# Altium project Probe.PrjPCB
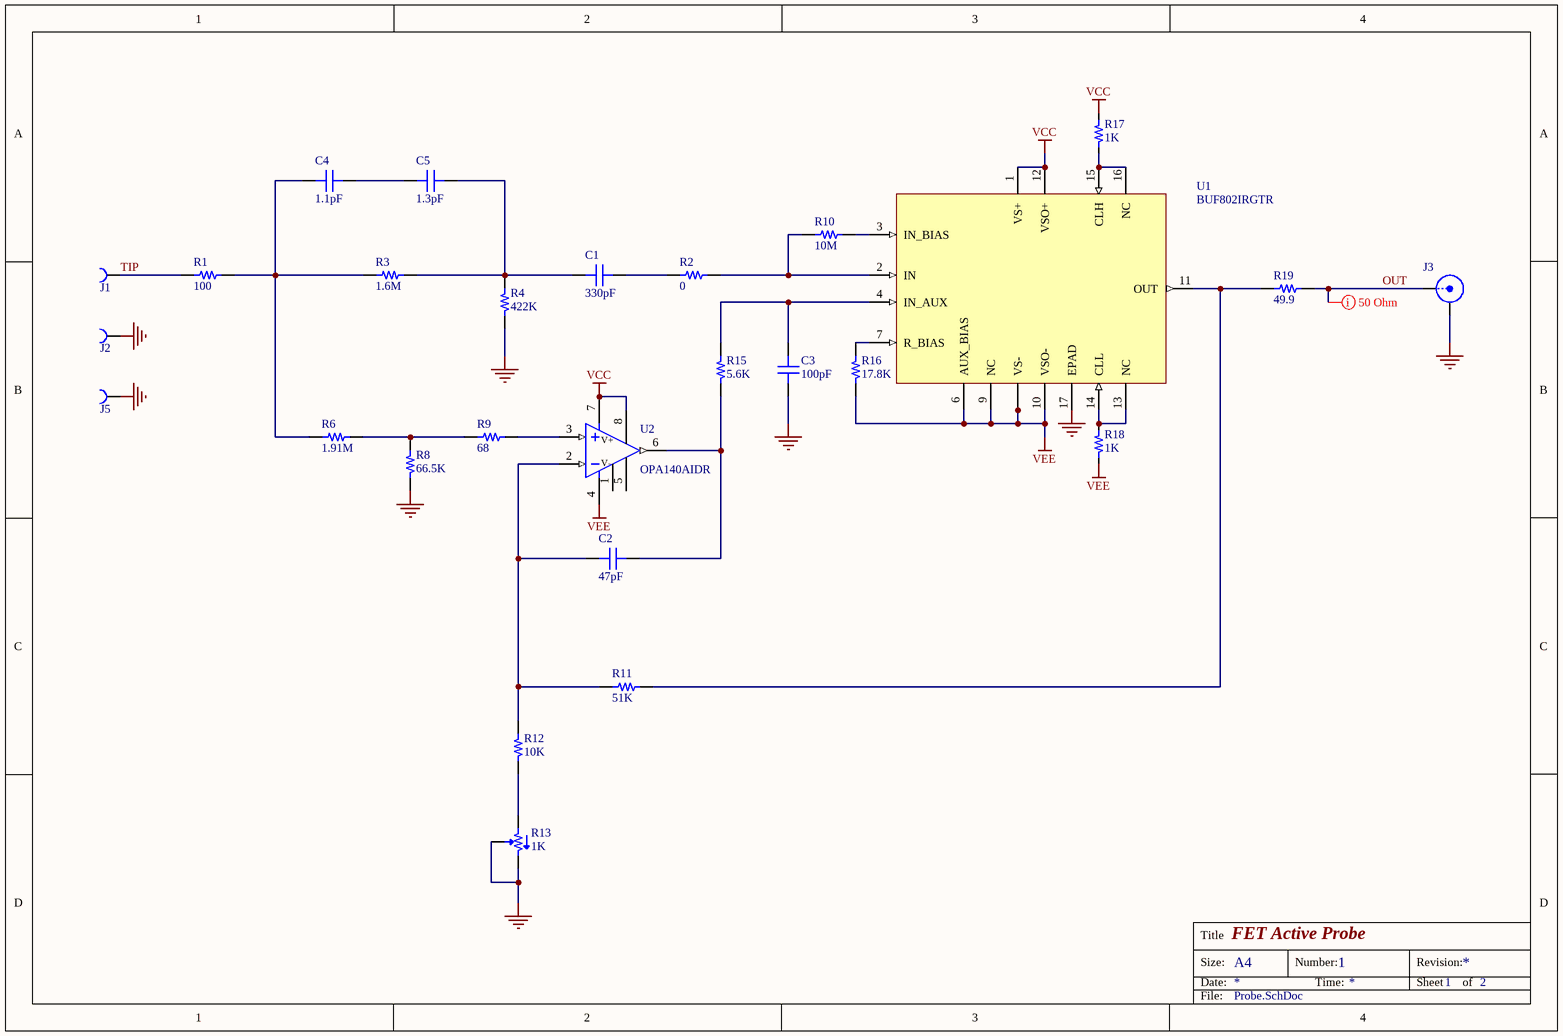
[diagram p0: Probe.SchDoc]
Draft: =#32
2 sheets, 69 parts. Net scope: global (net labels, ports and power ports of the same name join across sheets).
Board file: Probe.PcbDoc
Sheets:
  Probe.SchDoc
  Power.SchDoc

## Sheet Probe.SchDoc: FET Active Probe
size A4; DocumentNumber: 1; SheetNumber: 1; SheetTotal: 2

### Parts
C1  330pF  [CAP 0402/1005]
C2  47pF  [CAP 0402/1005]
C3  100pF  [CAP 0402/1005]
C4  1.1pF  [CAP 0402/1005 RF]
C5  1.3pF  [CAP 0402/1005 RF]
J1  0339-0-15-01-15-27-10-0  [MILL-MAX 0339]  (value not drawn)
J2  0339-0-15-01-15-27-10-0  [MILL-MAX 0339]  (value not drawn)
J3  CONN SMA JACK EDGE MNT  [60312202114513]  (value not drawn)
J5  0339-0-15-01-15-27-10-0  [MILL-MAX 0339]  (value not drawn)
R1  100  [RES 0402/1005]
R2  0  [RES 0402/1005]
R3  1.6M  [RES 0402/1005]
R4  422K  [RES 0402/1005]
R6  1.91M  [RES 0402/1005]
R8  66.5K  [RES 0402/1005]
R9  68  [RES 0402/1005]
R10  10M  [RES 0402/1005]
R11  51K  [RES 0402/1005]
R12  10K  [RES 0402/1005]
R13  1K  [BOURNS 3224W]
R15  5.6K  [RES 0402/1005]
R16  17.8K  [RES 0402/1005]
R17  1K  [RES 0402/1005]
R18  1K  [RES 0402/1005]
R19  49.9  [RES 0402/1005]
U1  BUF802IRGTR  [QFN50P305X305X100_HS-17N]
U2  OPA140AIDR  [TI SOIC-8 D]

### Nets
GND: C3.2 J2.1 J3.2(Y) J5.1 R4.2 R8.2 R13.2 R13.3 U1.17(EPAD)
VCC: R17.2 U1.1(VS+) U1.12(VSO+) U2.7(V+) U2.8
VEE: R16.2 R18.2 U1.5(VS-) U1.6(AUX_BIAS) U1.8(VS-) U1.9(NC) U1.10(VSO-) U2.4(V-)
OUT: J3.1(X) R19.2
TIP: J1.1 R1.1
NetC1_1: C1.1 C5.2 R3.2 R4.1
NetC1_2: C1.2 R2.1
NetC2_1: C2.1 R11.1 R12.1 U2.2(-IN)
NetC2_2: C2.2 R15.2 U2.6(OUT)
NetC3_1: C3.1 R15.1 U1.4(IN_AUX)
NetC4_1: C4.1 R1.2 R3.1 R6.1
NetC4_2: C4.2 C5.1
NetR2_2: R2.2 R10.1 U1.2(IN)
NetR6_2: R6.2 R8.1 R9.1
NetR9_2: R9.2 U2.3(+IN)
NetR10_2: R10.2 U1.3(IN_BIAS)
NetR11_2: R11.2 R19.1 U1.11(OUT)
NetR12_2: R12.2 R13.1
NetR16_1: R16.1 U1.7(R_BIAS)
NetR17_1: R17.1 U1.15(CLH) U1.16(NC)
NetR18_1: R18.1 U1.13(NC) U1.14(CLL)

Not connected (* = marked no-connect by the designer): U2 1 5(10)

### Layout directives
rule Width Constraint [Pref Impedance = 50.00ohms    Min Impedance = 50.00ohms    Max Impedance = 50.00ohms]: OUT

### Notes on the sheet
- Title
- Size:
- Date:
- A4
- Number:
- Time:
- Revision:
- Sheet
- of
- File:

### Library data of the parts
C1 = CM0293: CAP CER 330PF 50V NP0 0402; Manufacturer: Murata; Part Number: GRM1555C1H331JA01D; Tolerance: 5%; TemperatureRange: -55C ~ 125C; TemperatureCoefficient: C0G, NP0; Value: 330pF; PartId: CM0293; Supplier 1: Digi-Key; Supplier Part Number 1: 490-1295-2-ND; ComponentLink1Description: Datasheet; ComponentLink1URL: http://www.murata.com/~/media/webrenewal/support/library/catalog/products/capacitor/mlcc/c02e.ashx; ComponentLink2Description: Digi-Key listing; ComponentLink2URL: http://digikey.com/product-detail/en/GRM1555C1H331JA01D/490-1295-2-ND/587206; Voltage: 50V; Price: 0.009; Type: -; Device Package: 0402 (1005 Metric)
C2 = CM0224: CAP CER 47PF 50V NP0 0402; Manufacturer: Murata; Part Number: GRM1555C1H470FA01D; Tolerance: 1%; TemperatureRange: -55C ~ 125C; TemperatureCoefficient: C0G, NP0; Value: 47pF; PartId: CM0224; Supplier 1: Digi-Key; Supplier Part Number 1: 490-6241-2-ND; ComponentLink1Description: Datasheet; ComponentLink1URL: http://www.murata.com/~/media/webrenewal/support/library/catalog/products/capacitor/mlcc/c02e.ashx; ComponentLink2Description: Digi-Key listing; ComponentLink2URL: http://digikey.com/product-detail/en/GRM1555C1H470FA01D/490-6241-2-ND/3693991; Voltage: 50V; Price: 0.0133; Type: -; Device Package: 0402 (1005 Metric)
C3 = CM0248: CAP CER 100PF 50V NP0 0402; Manufacturer: Murata; Part Number: GRM1555C1H101FA01D; Tolerance: 1%; TemperatureRange: -55C ~ 125C; TemperatureCoefficient: C0G, NP0; Value: 100pF; PartId: CM0248; Supplier 1: Digi-Key; Supplier Part Number 1: 490-8180-2-ND; ComponentLink1Description: Datasheet; ComponentLink1URL: http://www.murata.com/~/media/webrenewal/support/library/catalog/products/capacitor/mlcc/c02e.pdf; ComponentLink2Description: Digi-Key Listing; ComponentLink2URL: https://www.digikey.com/product-detail/en/murata-electronics-north-america/GRM1555C1H101FA01D/490-8180-2-ND/3693919; Voltage: 50V; Price: 0.0092; Device Package: 0402 (1005 Metric)
C4 = CR1657: CAP CER 1.1PF +-0.05PF 50V NP0 0201; Part Number: GJM1555C1H1R1WB01D; Manufacturer: Murata; TemperatureRange: -55C ~ 125C; TemperatureCoefficient: C0G, NP0; Type: High Q, Low Loss; Tolerance: 0.05pF; Value: 1.1pF; PartId: CR1657; Supplier 1: Mouser; Supplier Part Number 1: 81-GJM1555C1H1R1WB01D; ComponentLink1Description: Datasheet; Voltage: 50V; Price: 0.02; Device Package: 0402 (1005 Metric); ComponentLink1URL: https://www.murata.com/en-eu/products/capacitor/ceramiccapacitor/overview/lineup/smd/gjm
C5 = CR1663: CAP CER 1.3PF +-0.05PF 50V NP0 0201; Part Number: GJM1555C1H1R3WB01D; Manufacturer: Murata; Tolerance: 0.05pF; TemperatureRange: -55C ~ 125C; TemperatureCoefficient: C0G, NP0; Type: High Q, Low Loss; Value: 1.3pF; PartId: CR1663; Supplier 1: Mouser; Supplier Part Number 1: 81-GJM1555C1H1R3WB01D; ComponentLink1Description: Datasheet; ComponentLink1URL: https://www.murata.com/en-eu/products/capacitor/ceramiccapacitor/overview/lineup/smd/gjm; Voltage: 50V; Price: 0.02; Device Package: 0402 (1005 Metric)
J1 J2 J5 = 0339-0-15-01-15-27-10-0: CONN PIN RCPT; Manufacturer: Mill-Max; Supplier 1: Digi-Key; Supplier Part Number 1: 0339-0-15-01-15-27-10-0-ND; Part Number: 0339-0-15-01-15-27-10-0; Stock 1: 989; Pricing 1: 1=1.42, 10=1.234, 25=1.1812, 50=1.155, 100=1.1025, 250=0.99748, 500=0.91874, 1000=0.7875, 2500=0.735 (USD); Contact Material: Copper; Contact Plating: Gold; Min Operating Temperature: -55°C; Max Operating Temperature: 125°C; Series: 0339; Packaging: Bulk; Termination: Solder; RoHS Compliant: No; ComponentLink1URL: https://www.mill-max.com/assets/pdfs/172.pdf?src-supplier=Digi-Key; ComponentLink1Description: https://www.mill-max.com/assets/pdfs/172.pdf?src-supplier=Digi-Key; ComponentLink2URL: https://datasheet.octopart.com/0339-0-15-01-15-27-10-0-Mill-Max-datasheet-26446830.pdf?src-supplier=Future+Electronics; ComponentLink2Description: https://datasheet.octopart.com/0339-0-15-01-15-27-10-0-Mill-Max-datasheet-26446830.pdf?src-supplier=Future+Electronics; ComponentLink3URL: http://www.mouser.com/ds/2/273/172M-276194.pdf?src-supplier=Mouser; ComponentLink3Description: http://www.mouser.com/ds/2/273/172M-276194.pdf?src-supplier=Mouser; ComponentLink4URL: https://datasheet.octopart.com/0339-0-15-01-15-27-10-0-Mill-Max-datasheet-155663258.pdf?src-supplier=Sager+Electronics; ComponentLink4Description: https://datasheet.octopart.com/0339-0-15-01-15-27-10-0-Mill-Max-datasheet-155663258.pdf?src-supplier=Sager+Electronics; Supplier 2: Mouser; Supplier Part Number 2: 575-0339015011527100
J3 = CRF016: WR-SMA Connector, PCB End Launch Jack, 6.35SQ Flange Flat Tab 1.6mm, DC~18GHz, 50Ohm; Manufacturer: Wurth; PartId: CRF016; Part Number: 60312202114513; ComponentLink1Description: Datasheet; ComponentLink1URL: https://www.we-online.com/redexpert/spec/603122021; Connector Type: SMA Jack; Mounting Technology: End Launch; Impedance: 50Ohm; Operating Temperature: -65C ~ 165C; Orientation: Straight; Supplier 1: Mouser; Supplier Part Number 1: 710-60312202114513; Supplier 2: Digi-Key; Supplier Part Number 2: 732-13844-ND
R1 = RC1250: RES SMD 100 OHM 1% 1/16W 0402; Part Number: RC0402FR-07100RL; Manufacturer: Yageo; TemperatureRange: -55C ~ 155C; TemperatureCoefficient: 100ppm/C; PowerRating: 0.0625W, 1/16W; Value: 100; PartId: RC1250; Supplier 1: Mouser; Supplier Part Number 1: 603-RC0402FR-07100RL; ComponentLink1Description: Datasheet; ComponentLink1URL: http://www.yageo.com/NewPortal/yageodocoutput?fileName=/pdf/R-Chip/PYu-RC_Group_51_RoHS_L_9.pdf; Tolerance: 1%; Price: 0.0043; Type: Thick Film; Device Package: 0402 (1005 Metric)
R2 = RC0971: RES SMD 0 OHM 5% 1/16W 0402; Part Number: RC0402JR-070RL; Manufacturer: Yageo; TemperatureRange: -55C ~ 155C; TemperatureCoefficient: 100ppm/C; PowerRating: 0.0625W, 1/16W; Value: 0; PartId: RC0971; Supplier 1: Mouser; Supplier Part Number 1: 603-RC0402JR-070RL; ComponentLink1Description: Datasheet; ComponentLink1URL: http://www.yageo.com/NewPortal/yageodocoutput?fileName=/pdf/R-Chip/PYu-RC_Group_51_RoHS_L_9.pdf; Tolerance: 5%; Price: 0.0043; Type: Thick Film; Device Package: 0402 (1005 Metric)
R3 = RC1837: RES SMD 1.6M OHM 1% 1/16W 0402; Part Number: RC0402FR-071M6L; Manufacturer: Yageo; TemperatureRange: -55C ~ 155C; TemperatureCoefficient: 100ppm/C; PowerRating: 0.0625W, 1/16W; Value: 1.6M; PartId: RC1837; Supplier 1: Mouser; Supplier Part Number 1: 603-RC0402FR-071M6L; ComponentLink1Description: Datasheet; ComponentLink1URL: http://www.yageo.com/NewPortal/yageodocoutput?fileName=/pdf/R-Chip/PYu-RC_Group_51_RoHS_L_9.pdf; Tolerance: 1%; Price: 0.0043; Type: Thick Film; Device Package: 0402 (1005 Metric)
R4 = RC1757: RES SMD 422K OHM 1% 1/16W 0402; Part Number: RC0402FR-07422KL; Manufacturer: Yageo; TemperatureRange: -55C ~ 155C; TemperatureCoefficient: 100ppm/C; PowerRating: 0.0625W, 1/16W; Value: 422K; PartId: RC1757; Supplier 1: Mouser; Supplier Part Number 1: 603-RC0402FR-07422KL; ComponentLink1Description: Datasheet; ComponentLink1URL: http://www.yageo.com/NewPortal/yageodocoutput?fileName=/pdf/R-Chip/PYu-RC_Group_51_RoHS_L_9.pdf; Tolerance: 1%; Price: 0.0043; Type: Thick Film; Device Package: 0402 (1005 Metric)
R6 = RC1847: RES SMD 1.91M OHM 1% 1/16W 0402; Part Number: RC0402FR-071M91L; Manufacturer: Yageo; TemperatureRange: -55C ~ 155C; TemperatureCoefficient: 100ppm/C; PowerRating: 0.0625W, 1/16W; Value: 1.91M; PartId: RC1847; Supplier 1: Mouser; Supplier Part Number 1: 603-RC0402FR-071M91L; ComponentLink1Description: Datasheet; ComponentLink1URL: http://www.yageo.com/NewPortal/yageodocoutput?fileName=/pdf/R-Chip/PYu-RC_Group_51_RoHS_L_9.pdf; Tolerance: 1%; Price: 0.0043; Type: Thick Film; Device Package: 0402 (1005 Metric)
R8 = RC1647: RES SMD 66.5K OHM 1% 1/16W 0402; Part Number: RC0402FR-0766K5L; Manufacturer: Yageo; TemperatureRange: -55C ~ 155C; TemperatureCoefficient: 100ppm/C; PowerRating: 0.0625W, 1/16W; Value: 66.5K; PartId: RC1647; Supplier 1: Mouser; Supplier Part Number 1: 603-RC0402FR-0766K5L; ComponentLink1Description: Datasheet; ComponentLink1URL: http://www.yageo.com/NewPortal/yageodocoutput?fileName=/pdf/R-Chip/PYu-RC_Group_51_RoHS_L_9.pdf; Tolerance: 1%; Price: 0.0043; Type: Thick Film; Device Package: 0402 (1005 Metric)
R9 = RC1227: RES SMD 68 OHM 1% 1/16W 0402; Part Number: RC0402FR-0768RL; Manufacturer: Yageo; TemperatureRange: -55C ~ 155C; TemperatureCoefficient: 100ppm/C; PowerRating: 0.0625W, 1/16W; Value: 68; PartId: RC1227; Supplier 1: Mouser; Supplier Part Number 1: 603-RC0402FR-0768RL; ComponentLink1Description: Datasheet; ComponentLink1URL: http://www.yageo.com/NewPortal/yageodocoutput?fileName=/pdf/R-Chip/PYu-RC_Group_51_RoHS_L_9.pdf; Tolerance: 1%; Price: 0.0043; Type: Thick Film; Device Package: 0402 (1005 Metric)
R10 = RC1949: RES SMD 10M OHM 1% 1/16W 0402; Part Number: RC0402FR-0710ML; Manufacturer: Yageo; TemperatureRange: -55C ~ 155C; TemperatureCoefficient: 100ppm/C; PowerRating: 0.0625W, 1/16W; Value: 10M; PartId: RC1949; Supplier 1: Mouser; Supplier Part Number 1: 603-RC0402FR-0710ML; ComponentLink1Description: Datasheet; ComponentLink1URL: http://www.yageo.com/NewPortal/yageodocoutput?fileName=/pdf/R-Chip/PYu-RC_Group_51_RoHS_L_9.pdf; Tolerance: 1%; Price: 0.0043; Type: Thick Film; Device Package: 0402 (1005 Metric)
R11 = RC1630: RES SMD 51K OHM 1% 1/16W 0402; Part Number: RC0402FR-0751KL; Manufacturer: Yageo; TemperatureRange: -55C ~ 155C; TemperatureCoefficient: 100ppm/C; PowerRating: 0.0625W, 1/16W; Value: 51K; PartId: RC1630; Supplier 1: Mouser; Supplier Part Number 1: 603-RC0402FR-0751KL; ComponentLink1Description: Datasheet; ComponentLink1URL: http://www.yageo.com/NewPortal/yageodocoutput?fileName=/pdf/R-Chip/PYu-RC_Group_51_RoHS_L_9.pdf; Tolerance: 1%; Price: 0.0043; Type: Thick Film; Device Package: 0402 (1005 Metric)
R12 = RC1531: RES SMD 10K OHM 1% 1/16W 0402; Part Number: RC0402FR-0710KL; Manufacturer: Yageo; TemperatureRange: -55C ~ 155C; TemperatureCoefficient: 100ppm/C; PowerRating: 0.0625W, 1/16W; Value: 10K; PartId: RC1531; Supplier 1: Mouser; Supplier Part Number 1: 603-RC0402FR-0710KL; ComponentLink1Description: Datasheet; ComponentLink1URL: http://www.yageo.com/NewPortal/yageodocoutput?fileName=/pdf/R-Chip/PYu-RC_Group_51_RoHS_L_9.pdf; Tolerance: 1%; Price: 0.0043; Type: Thick Film; Device Package: 0402 (1005 Metric)
R13 = PBT084: TRIMMER 1K OHM 0.25W J LEAD TOP; Manufacturer: Bourns; Part Number: 3224W-1-102E; Number of Turns: 12; Tolerance: 10%; TemperatureRange: -65C ~ 150C; TemperatureCoefficient: 100ppm/C; PowerRating: 0.25W, 1/4W; Adjustment Type: Top Adjustment; Resistive Material: Cermet; Supplier 1: Mouser; Supplier Part Number 1: 652-3224W-1-102E; ComponentLink1URL: https://www.bourns.com/docs/Product-Datasheets/3224.pdf; ComponentLink1Description: Datasheet; Supplier 2: Digi-Key; Supplier Part Number 2: 3224W-1-102ETR-ND; Value: 1K; PartId: PBT084; Price: 3.278; Device Package: Rectangular - 0.189" x 0.138" Face x 0.209" H (4.80mm x 3.50mm x 5.30mm); Mounting Type: Surface Mount
R15 = RC1496: RES SMD 5.6K OHM 1% 1/16W 0402; Part Number: RC0402FR-075K6L; Manufacturer: Yageo; TemperatureRange: -55C ~ 155C; TemperatureCoefficient: 100ppm/C; PowerRating: 0.0625W, 1/16W; Value: 5.6K; PartId: RC1496; Supplier 1: Mouser; Supplier Part Number 1: 603-RC0402FR-075K6L; ComponentLink1Description: Datasheet; ComponentLink1URL: http://www.yageo.com/NewPortal/yageodocoutput?fileName=/pdf/R-Chip/PYu-RC_Group_51_RoHS_L_9.pdf; Tolerance: 1%; Price: 0.0043; Type: Thick Film; Device Package: 0402 (1005 Metric)
R16 = RC1562: RES SMD 17.8K OHM 1% 1/16W 0402; Part Number: RC0402FR-0717K8L; Manufacturer: Yageo; TemperatureRange: -55C ~ 155C; TemperatureCoefficient: 100ppm/C; PowerRating: 0.0625W, 1/16W; Value: 17.8K; PartId: RC1562; Supplier 1: Mouser; Supplier Part Number 1: 603-RC0402FR-0717K8L; ComponentLink1Description: Datasheet; ComponentLink1URL: http://www.yageo.com/NewPortal/yageodocoutput?fileName=/pdf/R-Chip/PYu-RC_Group_51_RoHS_L_9.pdf; Tolerance: 1%; Price: 0.0043; Type: Thick Film; Device Package: 0402 (1005 Metric)
R17 R18 = RC1389: RES SMD 1K OHM 1% 1/16W 0402; Part Number: RC0402FR-071KL; Manufacturer: Yageo; TemperatureRange: -55C ~ 155C; TemperatureCoefficient: 100ppm/C; PowerRating: 0.0625W, 1/16W; Value: 1K; PartId: RC1389; Supplier 1: Mouser; Supplier Part Number 1: 603-RC0402FR-071KL; ComponentLink1Description: Datasheet; ComponentLink1URL: http://www.yageo.com/NewPortal/yageodocoutput?fileName=/pdf/R-Chip/PYu-RC_Group_51_RoHS_L_9.pdf; Tolerance: 1%; Price: 0.0043; Type: Thick Film; Device Package: 0402 (1005 Metric)
R19 = RC1206: RES SMD 49.9 OHM 1% 1/16W 0402; Part Number: RC0402FR-0749R9L; Manufacturer: Yageo; TemperatureRange: -55C ~ 155C; TemperatureCoefficient: 100ppm/C; PowerRating: 0.0625W, 1/16W; Value: 49.9; PartId: RC1206; Supplier 1: Mouser; Supplier Part Number 1: 603-RC0402FR-0749R9L; ComponentLink1Description: Datasheet; ComponentLink1URL: http://www.yageo.com/NewPortal/yageodocoutput?fileName=/pdf/R-Chip/PYu-RC_Group_51_RoHS_L_9.pdf; Tolerance: 1%; Price: 0.0043; Type: Thick Film; Device Package: 0402 (1005 Metric)
U1 = UO0077: IC AMP WIDE BANDWIDTH 16VQFN; Manufacturer: TI; PartId: UO0077; Part Number: BUF802IRGTR; Supplier 1: Digi-Key; Supplier Part Number 1: 296-BUF802IRGTRCT-ND; Supplier 2: Mouser; Supplier Part Number 2: 595-BUF802IRGTR; ComponentLink1Description: Datasheet; ComponentLink1URL: https://www.ti.com/lit/ds/symlink/buf802.pdf; Price: 6; Type: OPAMP; Device Package: 16-VQFN; Operating Temperature: -40C ~ 125C
U2 = UO0076: IC OPAMP JFET 1CIRC 8SOIC; Manufacturer: TI; PartId: UO0076; Part Number: OPA140AIDR; Supplier 1: Digi-Key; Supplier Part Number 1: 296-43606-2-ND; Supplier 2: Mouser; Supplier Part Number 2: 595-OPA140AIDR; ComponentLink1Description: Datasheet; ComponentLink1URL: https://www.ti.com/lit/ds/symlink/opa4140.pdf; Price: 4; Type: OPAMP; Device Package: 8-SOIC; Operating Temperature: -40C ~ 125C

## Sheet Power.SchDoc: FET Active Probe
size A4; DocumentNumber: 2; SheetNumber: 2; SheetTotal: 2
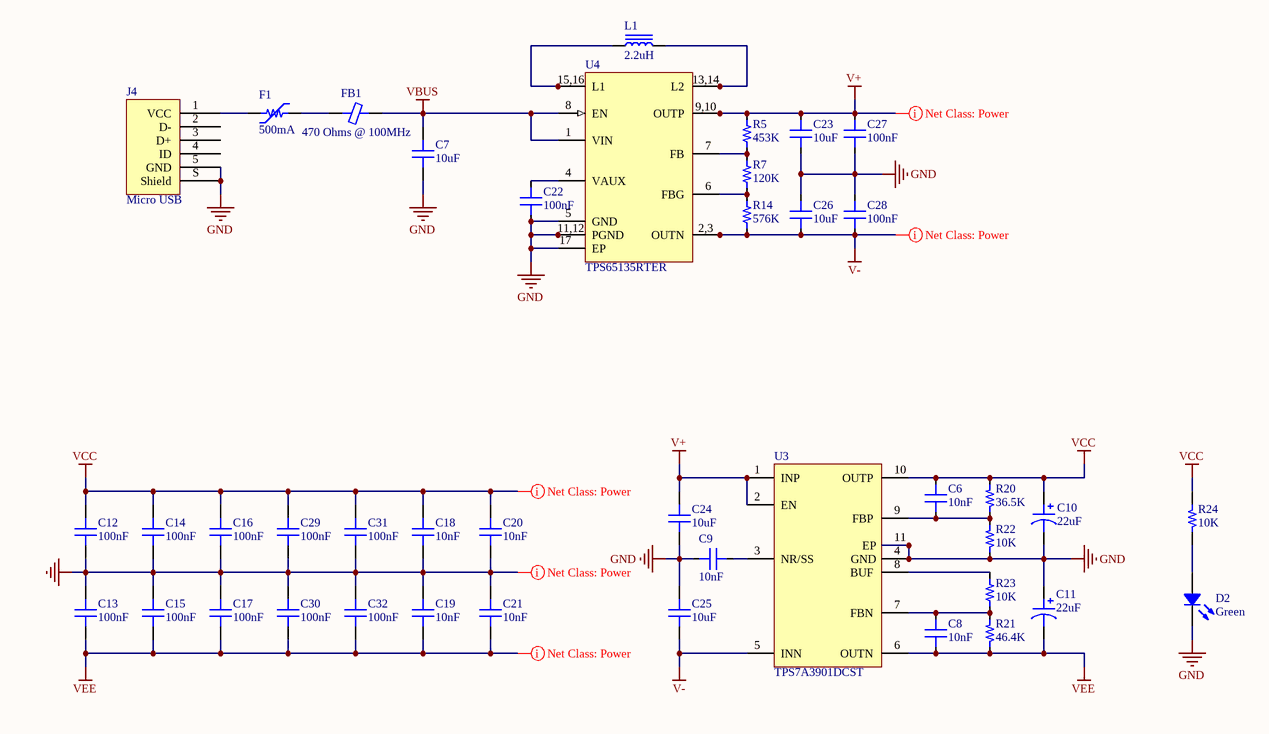
[diagram p1: Power.SchDoc]

### Parts
C6  10nF  [CAP 0402/1005]
C7  10uF  [CAP 0603/1608]
C8  10nF  [CAP 0402/1005]
C9  10nF  [CAP 0402/1005]
C10  22uF  [CAP TAN 3528 - 2.1MM]
C11  22uF  [CAP TAN 3528 - 2.1MM]
C12  100nF  [CAP 0402/1005]
C13  100nF  [CAP 0402/1005]
C14  100nF  [CAP 0204/0510]
C15  100nF  [CAP 0204/0510]
C16  100nF  [CAP 0204/0510]
C17  100nF  [CAP 0204/0510]
C18  10nF  [CAP 0402/1005]
C19  10nF  [CAP 0402/1005]
C20  10nF  [CAP 0402/1005]
C21  10nF  [CAP 0402/1005]
C22  100nF  [CAP 0402/1005]
C23  10uF  [CAP 0603/1608]
C24  10uF  [CAP 0603/1608]
C25  10uF  [CAP 0603/1608]
C26  10uF  [CAP 0603/1608]
C27  100nF  [CAP 0402/1005]
C28  100nF  [CAP 0402/1005]
C29  100nF  [CAP 0204/0510]
C30  100nF  [CAP 0204/0510]
C31  100nF  [CAP 0204/0510]
C32  100nF  [CAP 0204/0510]
D2  Green  [LED 0805/2012 GREEN]
F1  500mA  [PPTC 1206/3216]
FB1  470 Ohms @ 100MHz  [FER 0603/1608]
J4  Micro USB  [FCI USB 10118193-0001LF]
L1  2.2uH  [TDK VLS201612CX]
R5  453K  [RES 0402/1005]
R7  120K  [RES 0402/1005]
R14  576K  [RES 0402/1005]
R20  36.5K  [RES 0402/1005]
R21  46.4K  [RES 0402/1005]
R22  10K  [RES 0402/1005]
R23  10K  [RES 0402/1005]
R24  10K  [RES 0603/1608]
U3  TPS7A3901DCST  [DFN50P300X300X80_HS-11N]
U4  TPS65135RTER  [QFN50P305X305X100_HS-17N]

### Nets
GND: C7.1 C9.2 C10.2 C11.1 C12.2 C13.1 C14.2 C15.1 C16.2 C17.1 C18.2 C19.1 C20.2 C21.1 C22.2 C23.2 C24.2 C25.2 C26.1 C27.2 C28.1 C29.2 C30.1 C31.2 C32.1 D2.2 J4.5(GND) J4.S(Shield) R22.2 U3.4(GND) U3.11(EP) U4.5(GND) U4.11(PGND) U4.12(PGND) U4.17(EP)
V+: C23.1 C24.1 C27.1 R5.2 U3.1(INP) U3.2(EN) U4.9(OUTP) U4.10(OUTP)
V-: C25.1 C26.2 C28.2 R14.1 U3.5(INN) U4.2(OUTN) U4.3(OUTN)
VBUS: C7.2 FB1.2 U4.1(VIN) U4.8(EN)
VCC: C6.2 C10.1 C12.1 C14.1 C16.1 C18.1 C20.1 C29.1 C31.1 R20.1 R24.1 U3.10(OUTP)
VEE: C8.2 C11.2 C13.2 C15.2 C17.2 C19.2 C21.2 C30.2 C32.2 R21.2 U3.6(OUTN)
NetC6_1: C6.1 R20.2 R22.1 U3.9(FBP)
NetC8_1: C8.1 R21.1 R23.1 U3.7(FBN)
NetC9_1: C9.1 U3.3(NR/SS)
NetC22_1: C22.1 U4.4(VAUX)
NetD2_1: D2.1 R24.2
NetF1_1: F1.1 J4.1(VCC)
NetF1_2: F1.2 FB1.1
NetL1_1: L1.1 U4.15(L1) U4.16(L1)
NetL1_2: L1.2 U4.13(L2) U4.14(L2)
NetR5_1: R5.1 R7.2 U4.7(FB)
NetR7_1: R7.1 R14.2 U4.6(FBG)
NetR23_2: R23.2 U3.8(BUF)

Not connected (* = marked no-connect by the designer): J4 2(D-) 3(D+) 4(ID)

### Layout directives
net class Power: GND, V+, V-, VCC, VEE

### Notes on the sheet
- Title
- Size:
- Date:
- A4
- Number:
- Time:
- Revision:
- Sheet
- of
- File:
- (in symbol URS042) 15,16; 13,14; 9,10; 11,12; 2,3

### Library data of the parts
C6 C8 C9 = CM2150: CAP CER 10NF 25V NP0 0402; Manufacturer: Murata; Part Number: GRM1555C1E103GE01D; Tolerance: 2%; TemperatureRange: -55C ~ 125C; TemperatureCoefficient: C0G, NP0; Value: 10nF; PartId: CM2150; Supplier 1: Mouser; Supplier Part Number 1: 81-GRM1555C1E103GE1D; ComponentLink1Description: Datasheet; ComponentLink1URL: https://www.murata.com/en-global/products/productdetail?partno=GRM1555C1E103GE01%23; Voltage: 25V; Supplier 2: Digi-Key; Supplier Part Number 2: 490-GRM1555C1E103GE01DTR-ND; Price: 0.1; Device Package: 0402 (1005 Metric)
C7 C23 C26 = CM0904: CAP CER 10UF 16V X5R 0603; Part Number: GRM188R61C106MA73D; Manufacturer: Murata Electronics North America; TemperatureRange: -55C ~ 85C; Tolerance: 20%; Value: 10uF; PartId: CM0904; Supplier 1: Digi-Key; Supplier Part Number 1: 490-7201-2-ND; ComponentLink1Description: Datasheet; ComponentLink1URL: http://www.murata.com/~/media/webrenewal/support/library/catalog/products/capacitor/mlcc/c02e.pdf; ComponentLink2Description: Digi-Key Listing; ComponentLink2URL: https://www.digikey.com/product-detail/en/murata-electronics-north-america/GRM188R61C106MA73D/490-7201-2-ND/3900480; TemperatureCoefficient: X5R; Voltage: 16V; Price: 0.0736; Device Package: 0603 (1608 Metric)
C10 C11 = CAT304: CAP TANT 22UF 16V 3528; Manufacturer: AVX; Part Number: 293D226X0016B2TE3; Tolerance: 20%; Ripple Current: 0.21A; TemperatureRange: -55C ~ 125C; Impedance: 1.9Ohm @ 100kHz; Lifetime @ Temp: 1000 Hrs @ 85C; Supplier 1: Mouser; Supplier Part Number 1: 74-293D226X0016B2TE3; Series: 293D; Voltage: 16V; Height: 2.1mm; ComponentLink1URL: https://www.vishay.com/docs/40002/293d.pdf; ComponentLink1Description: Datasheet; Value: 22uF; PartID: CAT304; Device Package: 3528 x 2.1mm (Case B)
C12 C13 = CM0464: CAP CER 100NF 25V X5R 0402; Manufacturer: Murata; Part Number: GRM155R61E104KA87D; Tolerance: 10%; TemperatureRange: -55C ~ 85C; Supplier 1: Digi-Key; Voltage: 25V; ComponentLink1URL: http://www.murata.com/~/media/webrenewal/support/library/catalog/products/capacitor/mlcc/c02e.pdf; ComponentLink1Description: Datasheet; ComponentLink2URL: https://www.digikey.com/product-detail/en/murata-electronics-north-america/GRM155R61E104KA87D/490-5920-2-ND/3693681; ComponentLink2Description: Digi-Key Listing; Supplier Part Number 1: 490-5920-2-ND; PartId: CM0464; Value: 100nF; TemperatureCoefficient: X5R; Price: 0.0048; Device Package: 0402 (1005 Metric)
C14-C17 = CLW004: CAP CER 100NF 25V X5R 0204; Part Number: MSRLT103SB5104MFNA01; Manufacturer: Taiyo Yuden; TemperatureRange: -55C ~ 85C; Tolerance: 20%; Type: Reversal Decoupling Low ESL; PartId: CLW004; Value: 100nF; Supplier 1: Mouser; ComponentLink1Description: Datasheet; ComponentLink1URL: https://ds.yuden.co.jp/TYCOMPAS/or/detail?pn=MSRLT103SB5104MFNA01; TemperatureCoefficient: X5R; Voltage: 25V; Price: 0.02; Device Package: 0204 (0510 Metric); Supplier Part Number 1: 963-MSRLT103SB5104MFNA01
C18-C21 = CM2150: CAP CER 10NF 25V NP0 0402; Part Number: GRM1555C1E103GE01D; Manufacturer: Murata; Tolerance: 2%; TemperatureRange: -55C ~ 125C; TemperatureCoefficient: C0G, NP0; Value: 10nF; PartId: CM2150; Supplier 1: Mouser; Supplier Part Number 1: 81-GRM1555C1E103GE1D; ComponentLink1Description: Datasheet; ComponentLink1URL: https://www.murata.com/en-global/products/productdetail?partno=GRM1555C1E103GE01%23; Voltage: 25V; Price: 0.1; Device Package: 0402 (1005 Metric); Supplier 2: Digi-Key; Supplier Part Number 2: 490-GRM1555C1E103GE01DTR-ND
C22 = CM0464: CAP CER 100NF 25V X5R 0402; Part Number: GRM155R61E104KA87D; Manufacturer: Murata; TemperatureRange: -55C ~ 85C; Tolerance: 10%; Value: 100nF; PartId: CM0464; Supplier 1: Digi-Key; Supplier Part Number 1: 490-5920-2-ND; ComponentLink1Description: Datasheet; ComponentLink1URL: http://www.murata.com/~/media/webrenewal/support/library/catalog/products/capacitor/mlcc/c02e.pdf; ComponentLink2Description: Digi-Key Listing; ComponentLink2URL: https://www.digikey.com/product-detail/en/murata-electronics-north-america/GRM155R61E104KA87D/490-5920-2-ND/3693681; TemperatureCoefficient: X5R; Voltage: 25V; Price: 0.0048; Device Package: 0402 (1005 Metric)
C24 C25 = CM0904: CAP CER 10UF 16V X5R 0603; Manufacturer: Murata; Part Number: GRM188R61C106MA73D; TemperatureRange: -55C ~ 85C; Tolerance: 20%; Supplier 1: Digi-Key; Supplier Part Number 1: 490-7201-2-ND; ComponentLink1URL: http://www.murata.com/~/media/webrenewal/support/library/catalog/products/capacitor/mlcc/c02e.pdf; ComponentLink1Description: Datasheet; ComponentLink2URL: https://www.digikey.com/product-detail/en/murata-electronics-north-america/GRM188R61C106MA73D/490-7201-2-ND/3900480; ComponentLink2Description: Digi-Key Listing; PartId: CM0904; Value: 10uF; TemperatureCoefficient: X5R; Voltage: 16V; Price: 0.0736; Device Package: 0603 (1608 Metric)
C27 C28 = CM0464: CAP CER 100NF 25V X5R 0402; Part Number: GRM155R61E104KA87D; Manufacturer: Murata Electronics North America; TemperatureRange: -55C ~ 85C; Tolerance: 10%; Value: 100nF; PartId: CM0464; Supplier 1: Digi-Key; Supplier Part Number 1: 490-5920-2-ND; ComponentLink1Description: Datasheet; ComponentLink1URL: http://www.murata.com/~/media/webrenewal/support/library/catalog/products/capacitor/mlcc/c02e.pdf; ComponentLink2Description: Digi-Key Listing; ComponentLink2URL: https://www.digikey.com/product-detail/en/murata-electronics-north-america/GRM155R61E104KA87D/490-5920-2-ND/3693681; TemperatureCoefficient: X5R; Voltage: 25V; Price: 0.0048; Device Package: 0402 (1005 Metric)
C29-C32 = CLW004: CAP CER 100NF 25V X5R 0204; Manufacturer: Taiyo Yuden; Part Number: MSRLT103SB5104MFNA01; Tolerance: 20%; TemperatureRange: -55C ~ 85C; Type: Reversal Decoupling Low ESL; Supplier 1: Mouser; ComponentLink1URL: https://ds.yuden.co.jp/TYCOMPAS/or/detail?pn=MSRLT103SB5104MFNA01; ComponentLink1Description: Datasheet; PartId: CLW004; Value: 100nF; TemperatureCoefficient: X5R; Voltage: 25V; Price: 0.02; Device Package: 0204 (0510 Metric); Supplier Part Number 1: 963-MSRLT103SB5104MFNA01
D2 = LS0073: LED GREEN CLEAR 0805 SMD; Manufacturer: Lite-On Inc.; Part Number: LTST-C171KGKT; Viewing Angle: 130; Type: Surface Mount; Millicandela: 35mcd; Voltage Forward: 2V; Current (Test): 20mA; Supplier 1: Digi-Key; Supplier Part Number 1: 160-1426-2-ND; ComponentLink1URL: http://optoelectronics.liteon.com/upload/download/DS22-2000-118/LTST-C171KGKT.pdf; ComponentLink1Description: Datasheet; ComponentLink2URL: http://www.digikey.ca/product-detail/en/LTST-C171KGKT/160-1426-2-ND/386799; ComponentLink2Description: Digi-Key Listing; Value: Green; Colour: Green; PartId: LS0073; Price: 0.0638; Device Package: 0805 (2012 Metric); Lens Transparency: Clear
F1 = FP0006: PTC RESET FUSE 13.2V 500MA 1206; Part Number: NANOSMDC050F/13.2-2; Manufacturer: Littelfuse; TemperatureRange: -45C ~ 85C; Current - Max: 100A; Current - Trip (It): 1.1A; Time to Trip: 100ms; Resistance - Initial (Ri) (Min): 200 mOhms; Resistance - Post Trip (R1) (Max): 750 mOhms; PartId: FP0006; Supplier 1: Mouser; Supplier Part Number 1: 650-NANOSMDC050F/13.2-2; ComponentLink1Description: Datasheet; ComponentLink1URL: https://www.littelfuse.com/~/media/electronics/datasheets/resettable_ptcs/littelfuse_ptc_nanosmdc_datasheet.pdf.pdf; Type: PPTC; Voltage - Max: 13.2V; Current - Hold (Ih) (Max): 500mA; Supplier 2: Digikey; Supplier Part Number 2: NANOSMDC050F/13.2-2CT-ND; Price: 0.48; Device Package: 1206 (3216 Metric), Concave
FB1 = FTP046: FERRITE BEAD 470 OHM 0603 1LN; Part Number: MPZ1608B471ATA00; Manufacturer: TDK; DC Resistance: 150 mOhm; Current Rating: 1A; PartId: FTP046; Value: 470 Ohms @ 100MHz; Supplier 1: Digi-Key; Supplier Part Number 1: 445-5218-1-ND; ComponentLink1Description: Datasheet; ComponentLink1URL: https://product.tdk.com/info/en/catalog/datasheets/beads_commercial_power_mpz1608_en.pdf; Price: 0.1; Device Package: 0603 (1608 Metric)
J4 = CU0001: CONN USB MICRO B RECPT SMT R/A; Part Number: 10118193-0001LF; Manufacturer: FCI; Number Of Positions: 5; PartId: CU0001; Supplier 1: Digi-Key; Supplier Part Number 1: 609-4616-2-ND; ComponentLink1Description: Datasheet; ComponentLink1URL: http://portal.fciconnect.com/Comergent//fci/drawing/10118193.pdf; ComponentLink2Description: Digi-Key Listing; ComponentLink2URL: http://www.digikey.ca/product-detail/en/10118193-0001LF/609-4616-2-ND/2785388; Type: USB - micro B
L1 = ITV008: FIXED IND 2.2UH 1.5A 140 MOHM; Part Number: VLS201612CX-2R2M-1; Manufacturer: TDK; Tolerance: 20%; Current - Saturation: 1.33A; DC Resistance (DCR): 140 mOhm Max; Value: 2.2uH; PartId: ITV008; Supplier 1: Digi-Key; Supplier Part Number 1: 445-172963-1-ND; ComponentLink1Description: Datasheet; ComponentLink1URL: https://product.tdk.com/info/en/catalog/datasheets/inductor_commercial_power_vls201612cx-1_en.pdf; Device Package: 0806 (2016 Metric); Current Rating: 1.5A; Operating Temperature: 140 mOhm Max
R5 = RC1762: RES SMD 453K OHM 1% 1/16W 0402; Part Number: RC0402FR-07453KL; Manufacturer: Yageo; TemperatureRange: -55C ~ 155C; TemperatureCoefficient: 100ppm/C; PowerRating: 0.0625W, 1/16W; PartId: RC1762; Value: 453K; Supplier 1: Mouser; Supplier Part Number 1: 603-RC0402FR-07453KL; ComponentLink1Description: Datasheet; ComponentLink1URL: http://www.yageo.com/NewPortal/yageodocoutput?fileName=/pdf/R-Chip/PYu-RC_Group_51_RoHS_L_9.pdf; Tolerance: 1%; Price: 0.0043; Type: Thick Film; Device Package: 0402 (1005 Metric)
R7 = RC1682: RES SMD 120K OHM 1% 1/16W 0402; Part Number: RC0402FR-07120KL; Manufacturer: Yageo; TemperatureRange: -55C ~ 155C; TemperatureCoefficient: 100ppm/C; PowerRating: 0.0625W, 1/16W; PartId: RC1682; Value: 120K; Supplier 1: Mouser; Supplier Part Number 1: 603-RC0402FR-07120KL; ComponentLink1Description: Datasheet; ComponentLink1URL: http://www.yageo.com/NewPortal/yageodocoutput?fileName=/pdf/R-Chip/PYu-RC_Group_51_RoHS_L_9.pdf; Tolerance: 1%; Price: 0.0043; Type: Thick Film; Device Package: 0402 (1005 Metric)
R14 = RC1778: RES SMD 576K OHM 1% 1/16W 0402; Part Number: RC0402FR-07576KL; Manufacturer: Yageo; TemperatureRange: -55C ~ 155C; TemperatureCoefficient: 100ppm/C; PowerRating: 0.0625W, 1/16W; PartId: RC1778; Value: 576K; Supplier 1: Mouser; Supplier Part Number 1: 603-RC0402FR-07576KL; ComponentLink1Description: Datasheet; ComponentLink1URL: http://www.yageo.com/NewPortal/yageodocoutput?fileName=/pdf/R-Chip/PYu-RC_Group_51_RoHS_L_9.pdf; Tolerance: 1%; Price: 0.0043; Type: Thick Film; Device Package: 0402 (1005 Metric)
R20 = RC1608: RES SMD 36.5K OHM 1% 1/16W 0402; Part Number: RC0402FR-0736K5L; Manufacturer: Yageo; TemperatureRange: -55C ~ 155C; TemperatureCoefficient: 100ppm/C; PowerRating: 0.0625W, 1/16W; Value: 36.5K; PartId: RC1608; Supplier 1: Mouser; Supplier Part Number 1: 603-RC0402FR-0736K5L; ComponentLink1Description: Datasheet; ComponentLink1URL: http://www.yageo.com/NewPortal/yageodocoutput?fileName=/pdf/R-Chip/PYu-RC_Group_51_RoHS_L_9.pdf; Tolerance: 1%; Price: 0.0043; Type: Thick Film; Device Package: 0402 (1005 Metric)
R21 = RC1623: RES SMD 46.4K OHM 1% 1/16W 0402; Part Number: RC0402FR-0746K4L; Manufacturer: Yageo; TemperatureRange: -55C ~ 155C; TemperatureCoefficient: 100ppm/C; PowerRating: 0.0625W, 1/16W; Value: 46.4K; PartId: RC1623; Supplier 1: Mouser; Supplier Part Number 1: 603-RC0402FR-0746K4L; ComponentLink1Description: Datasheet; ComponentLink1URL: http://www.yageo.com/NewPortal/yageodocoutput?fileName=/pdf/R-Chip/PYu-RC_Group_51_RoHS_L_9.pdf; Tolerance: 1%; Price: 0.0043; Type: Thick Film; Device Package: 0402 (1005 Metric)
R22 R23 = RC1531: as R12 on sheet Probe; Value: 10K; PartId: RC1531; Supplier 1: Mouser; Supplier Part Number 1: 603-RC0402FR-0710KL; ComponentLink1Description: Datasheet; ComponentLink1URL: http://www.yageo.com/NewPortal/yageodocoutput?fileName=/pdf/R-Chip/PYu-RC_Group_51_RoHS_L_9.pdf; Tolerance: 1%; Price: 0.0043; Type: Thick Film; Device Package: 0402 (1005 Metric)
R24 = RC2513: RES SMD 10K OHM 5% 1/10W 0603; Part Number: RC0603JR-0710KL; Manufacturer: Yageo; TemperatureRange: -55C ~ 155C; TemperatureCoefficient: 100ppm/C; PowerRating: 0.1W, 1/10W; Value: 10K; PartId: RC2513; Supplier 1: Mouser; Supplier Part Number 1: 603-RC0603JR-0710KL; ComponentLink1Description: Datasheet; ComponentLink1URL: http://www.yageo.com/NewPortal/yageodocoutput?fileName=/pdf/R-Chip/PYu-RC_Group_51_RoHS_L_9.pdf; Tolerance: 5%; Price: 0.0043; Type: Thick Film; Device Package: 0603 (1608 Metric)
U3 = URL095: IC REG LIN POS/NEG ADJ 10WSON; Manufacturer: TI; Output Voltage: Adjustable; Output Current: 150mA; Input Voltage MAX: 30V; PartId: URL095; Part Number: TPS7A3901DCST; Supplier 1: Digi-Key; Supplier Part Number 1: 296-47504-1-ND; Supplier 2: Mouser; Supplier Part Number 2: 595-TPS7A3901DCST; ComponentLink1Description: Datasheet; ComponentLink1URL: https://www.ti.com/lit/gpn/tps7a39; Price: 1.5; Type: LDO; Device Package: 10-WFDFN; Operating Temperature: -40C ~ 125C
U4 = URS042: IC REG BOOST INV DUAL 16WQFN; Manufacturer: TI; PartId: URS042; Part Number: TPS65135RTER; Supplier 1: Mouser; Supplier Part Number 1: 595-TPS65135RTER; Supplier 2: Digi-Key; Supplier Part Number 2: 296-29899-2-ND; ComponentLink1Description: Datasheet; ComponentLink1URL: https://www.ti.com/lit/ds/symlink/tps65135.pdf; Price: 0.8; Type: Boost-Invert; Device Package: 16-WQFN; Operating Temperature: -40C ~ 85C

## Nets that join several sheets
GND: Probe (9 pins), Power (35 pins)
VCC: Probe (5 pins), Power (12 pins)
VEE: Probe (8 pins), Power (11 pins)